# Altium schematic sheet MDQARM_FM_Tx.SchDoc
size A3; Organization: Altium Limited; Address1: L3, 12a Rodborough Rd; Address2: Frenchs Forest; Address3: NSW; Address4: Australia 2086
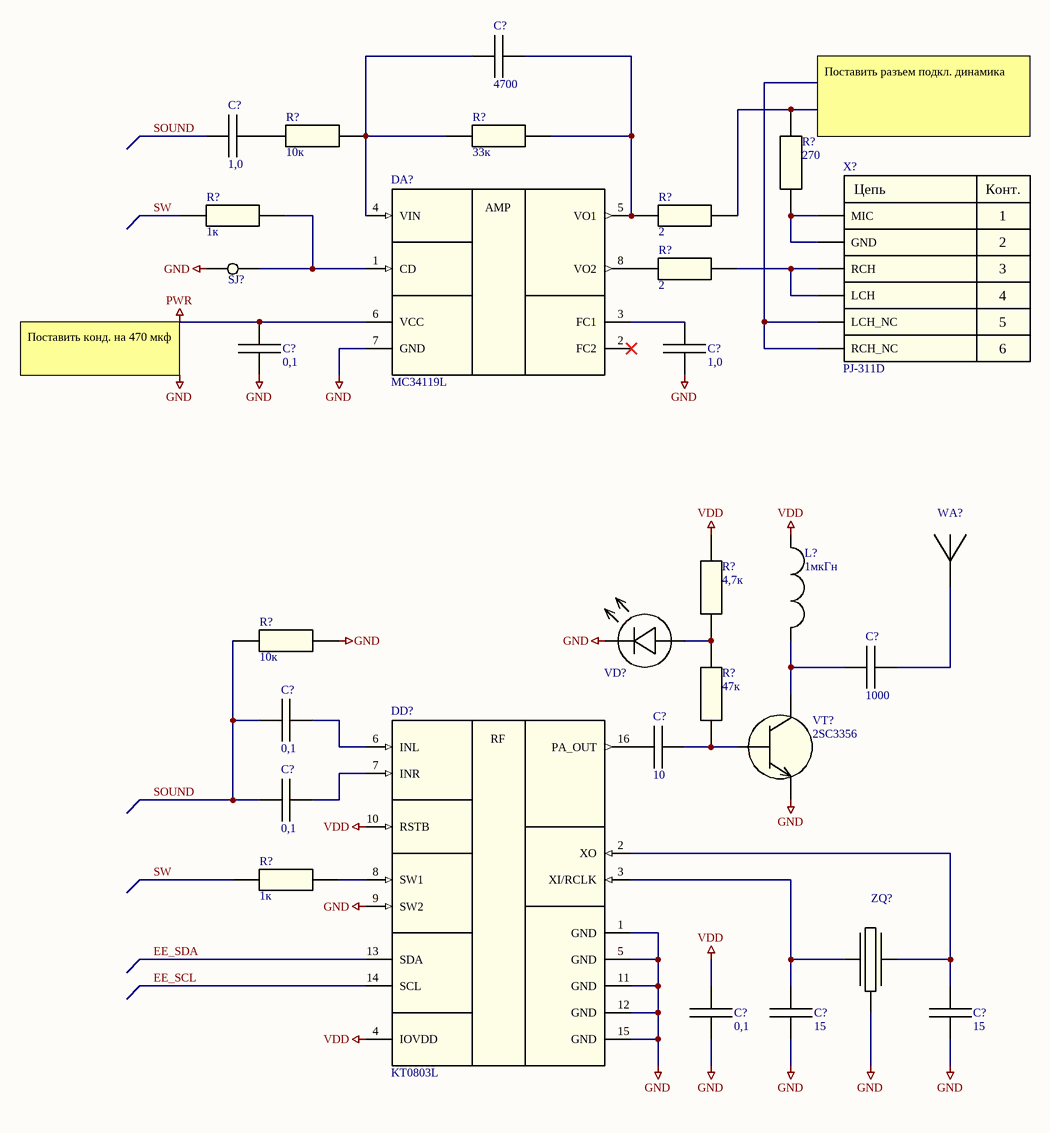
[diagram p0: MDQARM_FM_Tx.SchDoc]

## Parts
(Parts that share a designator on the sheet are numbered #1, #2 ... from top to bottom, then left to right.)
C?#1  4700  [Capacitor SMD0805-T0.75]
C?#2  1,0  [Capacitor SMD0805-T1.35]
C?#3  0,1  [Capacitor SMD0805-T0.95]
C?#4  1,0  [Capacitor SMD0805-T1.35]
C?#5  1000  [Capacitor SMD0805-T0.75]
C?#6  0,1  [Capacitor SMD0805-T0.95]
C?#7  10  [Capacitor SMD0805-T0.75]
C?#8  0,1  [Capacitor SMD0805-T0.95]
C?#9  15  [Capacitor SMD0805-T0.75]
C?#10  15  [Capacitor SMD0805-T0.75]
C?#11  0,1  [Capacitor SMD0805-T0.95]
DA?  MC34119L  [IC MC34119L]
DD?  KT0803L  [IC KT0803L]
L?  1мкГн  [Inductor SMD1210]
R?#1  10к  [Resistor SMD0805]
R?#2  33к  [Resistor SMD0805]
R?#3  1к  [Resistor SMD0805]
R?#4  2  [Resistor SMD0805]
R?#5  270  [Resistor SMD0805]
R?#6  2  [Resistor SMD0805]
R?#7  4,7к  [Resistor SMD0805]
R?#8  10к  [Resistor SMD0805]
R?#9  47к  [Resistor SMD0805]
R?#10  1к  [Resistor SMD0805]
SJ?  SolderJump 1  [SolderJump 1]  (value not drawn)
VD?  RED  [Diode SMD0805]  (value not drawn)
VT?  2SC3356  [Transistor SOT23]
WA?  Antenna 1  [Antenna 1]  (value not drawn)
X?  PJ-311D  [Connector PJ-311D]
ZQ?  32768 Гц  [Quartz DT-38T-32768Hz]  (value not drawn)

## Nets
GND: C?#3.1 C?#4.1 C?#9.2 C?#10.2 C?#11.1 DA?.7(GND) DD?.1(GND) DD?.5(GND) DD?.9(SW2) DD?.11(GND) DD?.12(GND) DD?.15(GND) R?#8.2 SJ?.2 VD?.2(C) VT?.2(E) ZQ?.3(GND)
PWR: C?#3.2 DA?.6(VCC)
VDD: C?#11.2 DD?.4(IOVDD) DD?.10(RSTB) L?.1 R?#7.1
EE_SCL: DD?.14(SCL)
EE_SDA: DD?.13(SDA)
SOUND: C?#2.1 C?#6.1 C?#8.1 R?#8.1
SW: R?#3.1 R?#10.1
NetC?#1_1: C?#1.1 DA?.4(VIN) R?#1.2 R?#2.1
NetC?#1_2: C?#1.2 DA?.5(VO1) R?#2.2 R?#4.1
NetC?#2_2: C?#2.2 R?#1.1
NetC?#4_2: C?#4.2 DA?.3(FC1)
NetC?#5_1: C?#5.1 L?.2 VT?.3(C)
NetC?#5_2: C?#5.2 WA?.1
NetC?#6_2: C?#6.2 DD?.6(INL)
NetC?#7_1: C?#7.1 DD?.16(PA_OUT)
NetC?#7_2: C?#7.2 R?#9.1 VT?.1(B)
NetC?#8_2: C?#8.2 DD?.7(INR)
NetC?#9_1: C?#9.1 DD?.3(XI/RCLK) ZQ?.2
NetC?#10_1: C?#10.1 DD?.2(XO) ZQ?.1
NetDA?_1: DA?.1(CD) R?#3.2 SJ?.1
NetDA?_8: DA?.8(VO2) R?#6.1
NetDD?_8: DD?.8(SW1) R?#10.2
NetR?#4_2: R?#4.2 R?#5.2
NetR?#5_1: R?#5.1 X?.1(MIC) X?.2(GND)
NetR?#6_2: R?#6.2 X?.3(RCH) X?.4(LCH)
NetR?#7_2: R?#7.2 R?#9.2 VD?.1(A)
NetX?_5: X?.5(LCH_NC) X?.6(RCH_NC)

Not connected (* = marked no-connect by the designer): DA? 2(FC2)*

## Notes on the sheet
- (near R?#5) Поставить разъем подкл. динамика
- Поставить конд. на 470 мкф
- Labels drawn without touching a wire or pin: GND
- Title
- Size:
- Date:
- A3
- Number:
- Time:
- Revision:
- Sheet
- of
- File:
- (in symbol Connector PJ-311D) Цепь; Конт.
- (in symbol IC KT0803L) RF
- (in symbol IC MC34119L) AMP

## Library data of the parts
C?#1 = Capacitor C0805_4.7n: Value: 4700
C?#2 C?#4 = Capacitor C0805_1u: Value: 1,0
C?#3 C?#6 C?#8 C?#11 = Capacitor C0805_100n: Value: 0,1
C?#5 = Capacitor C0805_1n: Value: 1000
C?#7 = Capacitor C0805_10p: Value: 10
C?#9 C?#10 = Capacitor C0805_15p: Value: 15
DA? = IC MC34119L: Value: MC34119L
DD? = IC KT0803L: Value: KT0803L
L? = Inductance L1210_1uH: Value: 1мкГн
R?#1 R?#8 = Resistor R0805_10k_5%: Value: 10к
R?#2 = Resistor R0805_33k_5%: Value: 33к
R?#3 R?#10 = Resistor R0805_1k_5%: Value: 1к
R?#4 R?#6 = Resistor R0805_2R_5%: Value: 2
R?#5 = Resistor R0805_270R_5%: Value: 270
R?#7 = Resistor R0805_4.7k_5%: Value: 4,7к
R?#9 = Resistor R0805_47k_5%: Value: 47к
VD? = Diode LED0805RED: LED Red SMD0805
VT? = Transistor 2SC3356: Value: 2SC3356
X? = Connector PJ-311D: Audio Jack 3.5mm; Value: PJ-311D
ZQ? = Quartz DT-38T-32768Hz: Value: DT-38T-32768Hz